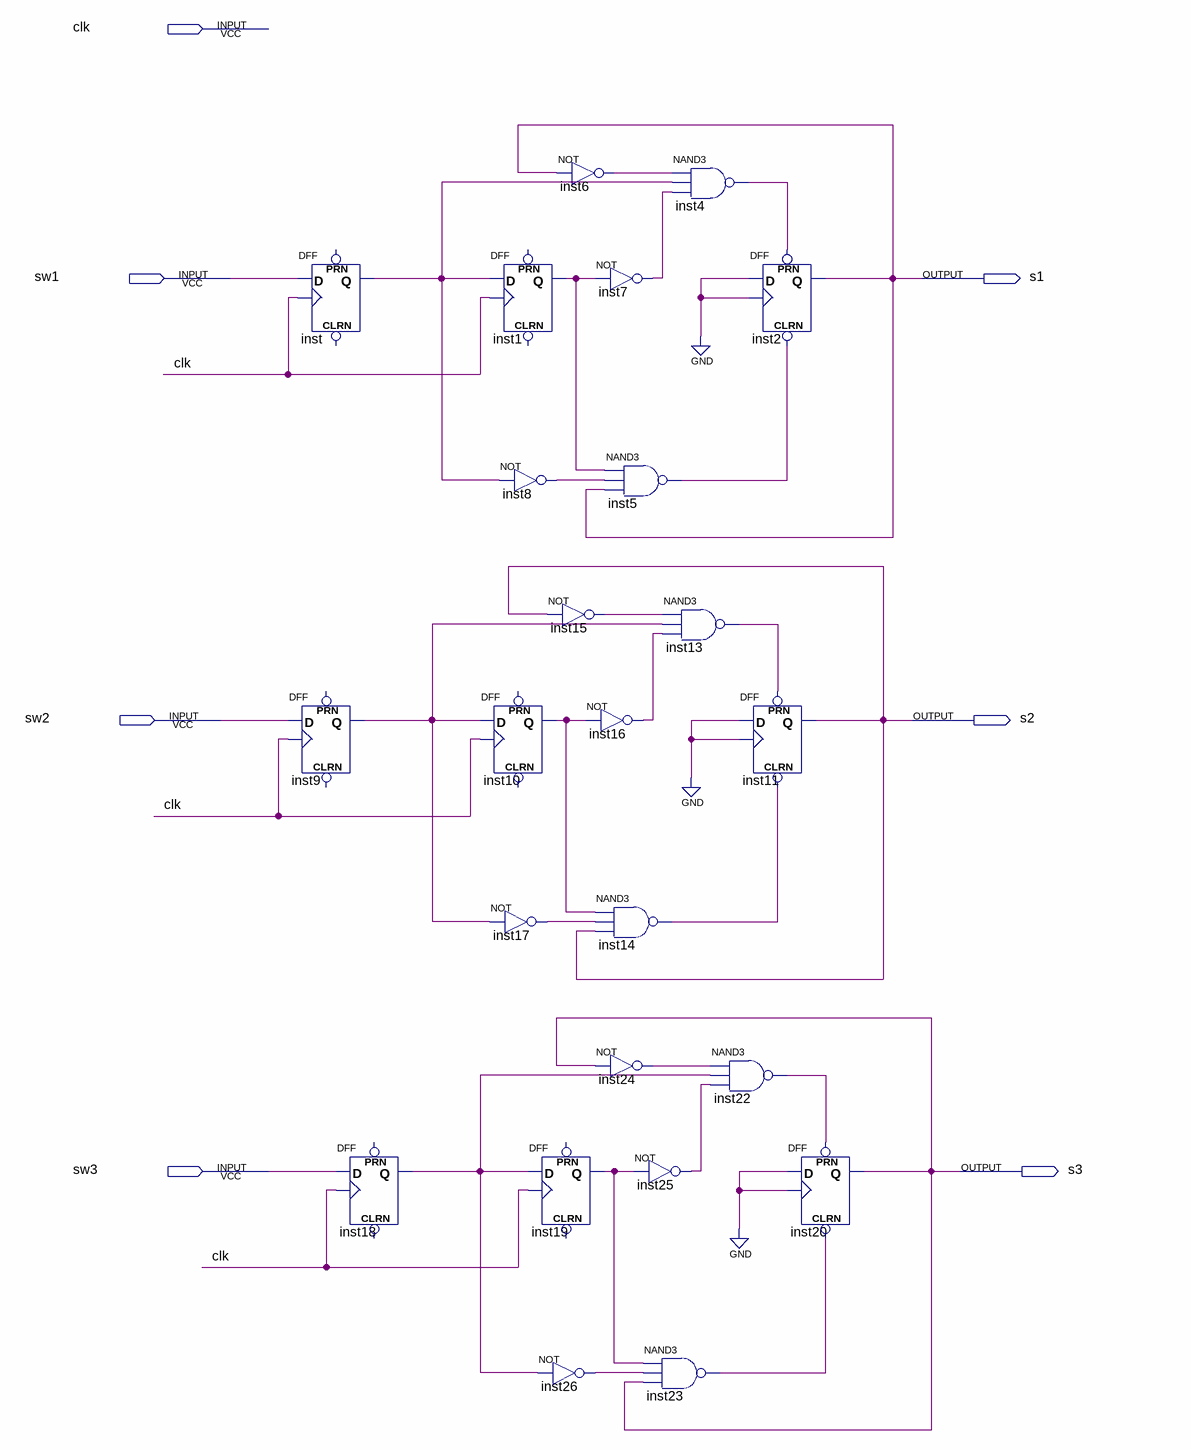
[diagram p0: schematic sheet]
// Quartus schematic sw.bdf as structural Verilog: 24 symbols, 7 pins
module sw (
  input  clk,
  input  sw1,
  input  sw2,
  input  sw3,
  output s1,
  output s2,
  output s3
);

  wire inst1_q, inst4_out, inst5_out, inst6_out, inst7_out, inst8_out, inst9_q, inst10_q, inst13_out,
       inst14_out, inst15_out, inst16_out, inst17_out, inst18_q, inst19_q, inst22_out, inst23_out,
       inst24_out, inst25_out, inst26_out, inst_q;

  DFF inst9 (.CLK(clk), .D(sw2), .Q(inst9_q));  // open: CLRN, PRN
  DFF inst (.CLK(clk), .D(sw1), .Q(inst_q));  // open: CLRN, PRN
  DFF inst18 (.CLK(clk), .D(sw3), .Q(inst18_q));  // open: CLRN, PRN
  DFF inst1 (.CLK(clk), .D(inst_q), .Q(inst1_q));  // open: CLRN, PRN
  not inst8 (inst8_out, inst_q);
  DFF inst10 (.CLK(clk), .D(inst9_q), .Q(inst10_q));  // open: CLRN, PRN
  not inst17 (inst17_out, inst9_q);
  not inst6 (inst6_out, s1);
  not inst7 (inst7_out, inst1_q);
  not inst15 (inst15_out, s2);
  not inst16 (inst16_out, inst10_q);
  nand inst14 (inst14_out, inst10_q, inst17_out, s2);
  not inst24 (inst24_out, s3);
  DFF inst19 (.CLK(clk), .D(inst18_q), .Q(inst19_q));  // open: CLRN, PRN
  not inst26 (inst26_out, inst18_q);
  nand inst4 (inst4_out, inst6_out, inst_q, inst7_out);
  nand inst5 (inst5_out, inst1_q, inst8_out, s1);
  nand inst13 (inst13_out, inst15_out, inst9_q, inst16_out);
  not inst25 (inst25_out, inst19_q);
  nand inst23 (inst23_out, inst19_q, inst26_out, s3);
  DFF inst2 (.CLRN(inst5_out), .CLK(1'b0), .D(1'b0), .PRN(inst4_out), .Q(s1));
  DFF inst11 (.CLRN(inst14_out), .CLK(1'b0), .D(1'b0), .PRN(inst13_out), .Q(s2));
  nand inst22 (inst22_out, inst24_out, inst18_q, inst25_out);
  DFF inst20 (.CLRN(inst23_out), .CLK(1'b0), .D(1'b0), .PRN(inst22_out), .Q(s3));
endmodule
